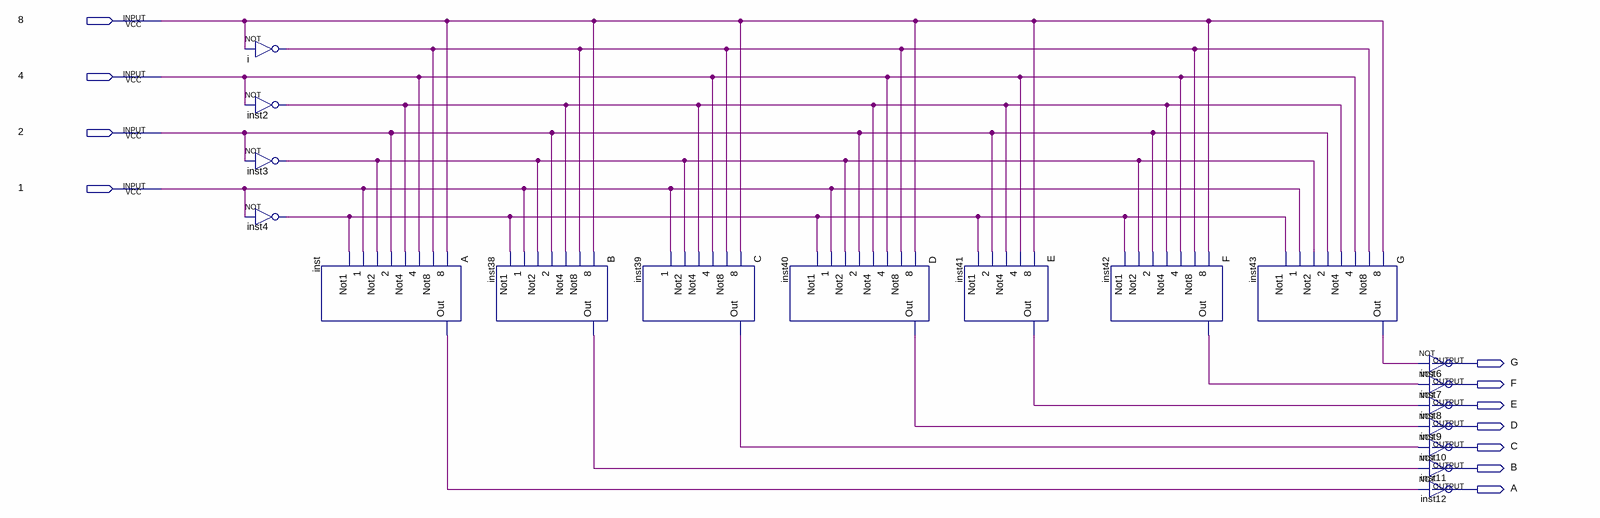
[diagram p0: schematic sheet]
// Quartus schematic Bin_to_Hex.bdf as structural Verilog: 18 symbols, 11 pins
module Bin_to_Hex (
  input  \8 ,
  input  \4 ,
  input  \2 ,
  input  \1 ,
  output G,
  output F,
  output E,
  output D,
  output C,
  output B,
  output A
);

  wire i_out, inst2_out, inst3_out, inst4_out, inst38_out, inst39_out, inst40_out, inst41_out, inst42_out,
       inst43_out, inst_out;

  not i (i_out, \8 );
  not inst2 (inst2_out, \4 );
  not inst3 (inst3_out, \2 );
  not inst4 (inst4_out, \1 );
  A inst (
    .\8 (\8 ), .Not8(i_out), .\4 (\4 ), .Not4(inst2_out), .\2 (\2 ), .Not2(inst3_out), .\1 (\1 ),
    .Not1(inst4_out), .Out(inst_out));
  B inst38 (
    .\8 (\8 ), .Not8(i_out), .Not4(inst2_out), .\2 (\2 ), .Not2(inst3_out), .\1 (\1 ), .Not1(inst4_out),
    .Out(inst38_out));
  C inst39 (.\8 (\8 ), .Not8(i_out), .\4 (\4 ), .Not4(inst2_out), .Not2(inst3_out), .\1 (\1 ), .Out(inst39_out));
  D inst40 (
    .\8 (\8 ), .Not8(i_out), .\4 (\4 ), .Not4(inst2_out), .\2 (\2 ), .Not2(inst3_out), .\1 (\1 ),
    .Not1(inst4_out), .Out(inst40_out));
  E inst41 (.\8 (\8 ), .\4 (\4 ), .Not4(inst2_out), .\2 (\2 ), .Not1(inst4_out), .Out(inst41_out));
  F inst42 (
    .\8 (\8 ), .Not8(i_out), .\4 (\4 ), .Not4(inst2_out), .\2 (\2 ), .Not2(inst3_out), .Not1(inst4_out),
    .Out(inst42_out));
  G inst43 (
    .\8 (\8 ), .Not8(i_out), .\4 (\4 ), .Not4(inst2_out), .\2 (\2 ), .Not2(inst3_out), .\1 (\1 ),
    .Not1(inst4_out), .Out(inst43_out));
  not inst6 (G, inst43_out);
  not inst7 (F, inst42_out);
  not inst8 (E, inst41_out);
  not inst9 (D, inst40_out);
  not inst10 (C, inst39_out);
  not inst11 (B, inst38_out);
  not inst12 (A, inst_out);
endmodule
